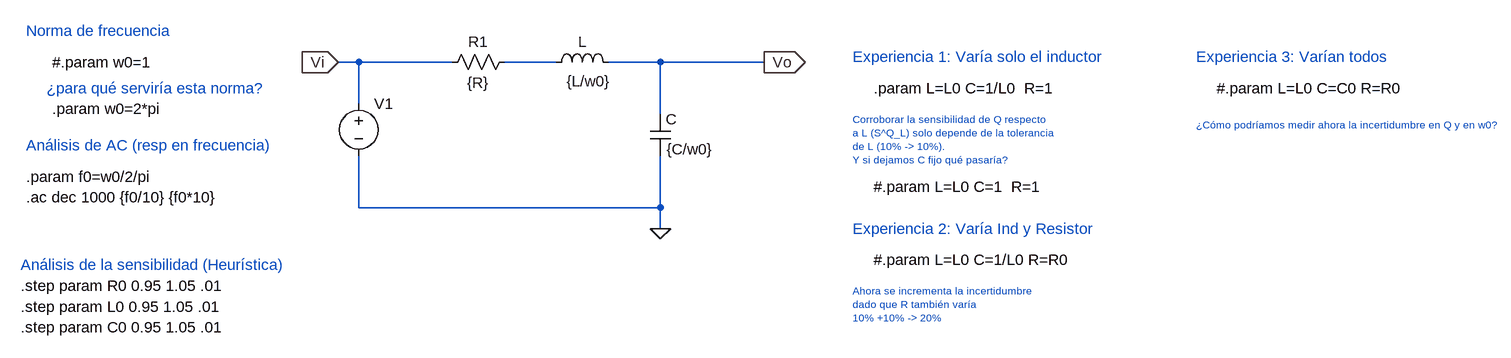
[diagram p0: schematic SOS RLC LP sensibilidad heur.asc]
SOS RLC LP sensibilidad heur.asc, the LTspice schematic file:
Version 4
SHEET 1 1660 680
WIRE -224 112 -256 112
WIRE -80 112 -224 112
WIRE 80 112 0 112
WIRE 240 112 160 112
WIRE 400 112 240 112
WIRE -224 176 -224 112
WIRE 240 192 240 112
WIRE -224 336 -224 256
WIRE 240 336 240 256
WIRE 240 336 -224 336
WIRE 240 368 240 336
FLAG -256 112 Vi
IOPIN -256 112 In
FLAG 400 112 Vo
IOPIN 400 112 Out
FLAG 240 368 0
SYMBOL ind 64 128 R270
WINDOW 0 32 56 VTop 2
WINDOW 3 -29 66 VTop 2
SYMATTR InstName L
SYMATTR Value {L/w0}
SYMBOL cap 224 192 R0
WINDOW 3 26 54 Left 2
SYMATTR Value {C/w0}
SYMATTR InstName C
SYMBOL voltage -224 160 R0
WINDOW 3 24 96 Invisible 2
WINDOW 39 0 0 Left 0
SYMATTR Value SINE(0 1 0 0 0 0 1000)
SYMATTR InstName V1
SYMATTR Value2 AC 1 0
SYMBOL res 16 96 R90
WINDOW 0 0 56 VBottom 2
WINDOW 3 32 56 VTop 2
SYMATTR InstName R1
SYMATTR Value {R}
TEXT -736 320 Left 2 !.ac dec 1000 {f0/10} {f0*10}
TEXT -744 520 Left 2 !.step param C0 0.95 1.05 .01
TEXT -744 488 Left 2 !.step param L0 0.95 1.05 .01
TEXT -744 456 Left 2 !.step param R0 0.95 1.05 .01
TEXT -736 288 Left 2 !.param f0=w0/2/pi
TEXT -696 184 Left 2 !.param w0=2*pi
TEXT -696 112 Left 2 !#.param w0=1
TEXT -736 64 Left 2 ;Norma de frecuencia
TEXT -704 152 Left 2 ;¿para qué serviría esta norma?
TEXT -736 240 Left 2 ;Análisis de AC (resp en frecuencia)
TEXT -744 424 Left 2 ;Análisis de la sensibilidad (Heurística)
TEXT 536 104 Left 2 ;Experiencia 1: Varía solo el inductor
TEXT 568 152 Left 2 !.param L=L0 C=1/L0  R=1
TEXT 536 368 Left 2 ;Experiencia 2: Varía Ind y Resistor
TEXT 568 416 Left 2 !#.param L=L0 C=1/L0 R=R0
TEXT 536 200 Left 1 ;Corroborar la sensibilidad de Q respecto \na L (S^Q_L) solo depende de la tolerancia\nde L (10% -> 10%).\nY si dejamos C fijo qué pasaría?
TEXT 536 464 Left 1 ;Ahora se incrementa la incertidumbre\ndado que R también varía \n10% +10% -> 20%
TEXT 1064 104 Left 2 ;Experiencia 3: Varían todos
TEXT 1096 152 Left 2 !#.param L=L0 C=C0 R=R0
TEXT 1064 208 Left 1 ;¿Cómo podríamos medir ahora la incertidumbre en Q y en w0?
TEXT 568 304 Left 2 !#.param L=L0 C=1  R=1

The netlist it stands for:
* SOS RLC LP sensibilidad heur.asc
L N001 Vo {L/w0}
C Vo 0 {C/w0}
V1 Vi 0 SINE(0 1 0 0 0 0 1000) AC 1 0
R1 N001 Vi {R}
.ac dec 1000 {f0/10} {f0*10}
.step param C0 0.95 1.05 .01
.step param L0 0.95 1.05 .01
.step param R0 0.95 1.05 .01
.param f0=w0/2/pi
.param w0=2*pi
#.param w0=1
* Norma de frecuencia
* ¿para qué serviría esta norma?
* Análisis de AC (resp en frecuencia)
* Análisis de la sensibilidad (Heurística)
* Experiencia 1: Varía solo el inductor
.param L=L0 C=1/L0  R=1
* Experiencia 2: Varía Ind y Resistor
#.param L=L0 C=1/L0 R=R0
* Corroborar la sensibilidad de Q respecto
* a L (S^Q_L) solo depende de la tolerancia
* de L (10% -> 10%).
* Y si dejamos C fijo qué pasaría?
* Ahora se incrementa la incertidumbre
* dado que R también varía
* 10% +10% -> 20%
* Experiencia 3: Varían todos
#.param L=L0 C=C0 R=R0
* ¿Cómo podríamos medir ahora la incertidumbre en Q y en w0?
#.param L=L0 C=1  R=1
.backanno
.end